# EAGLE design schematic (EAGLE 6.5.0)
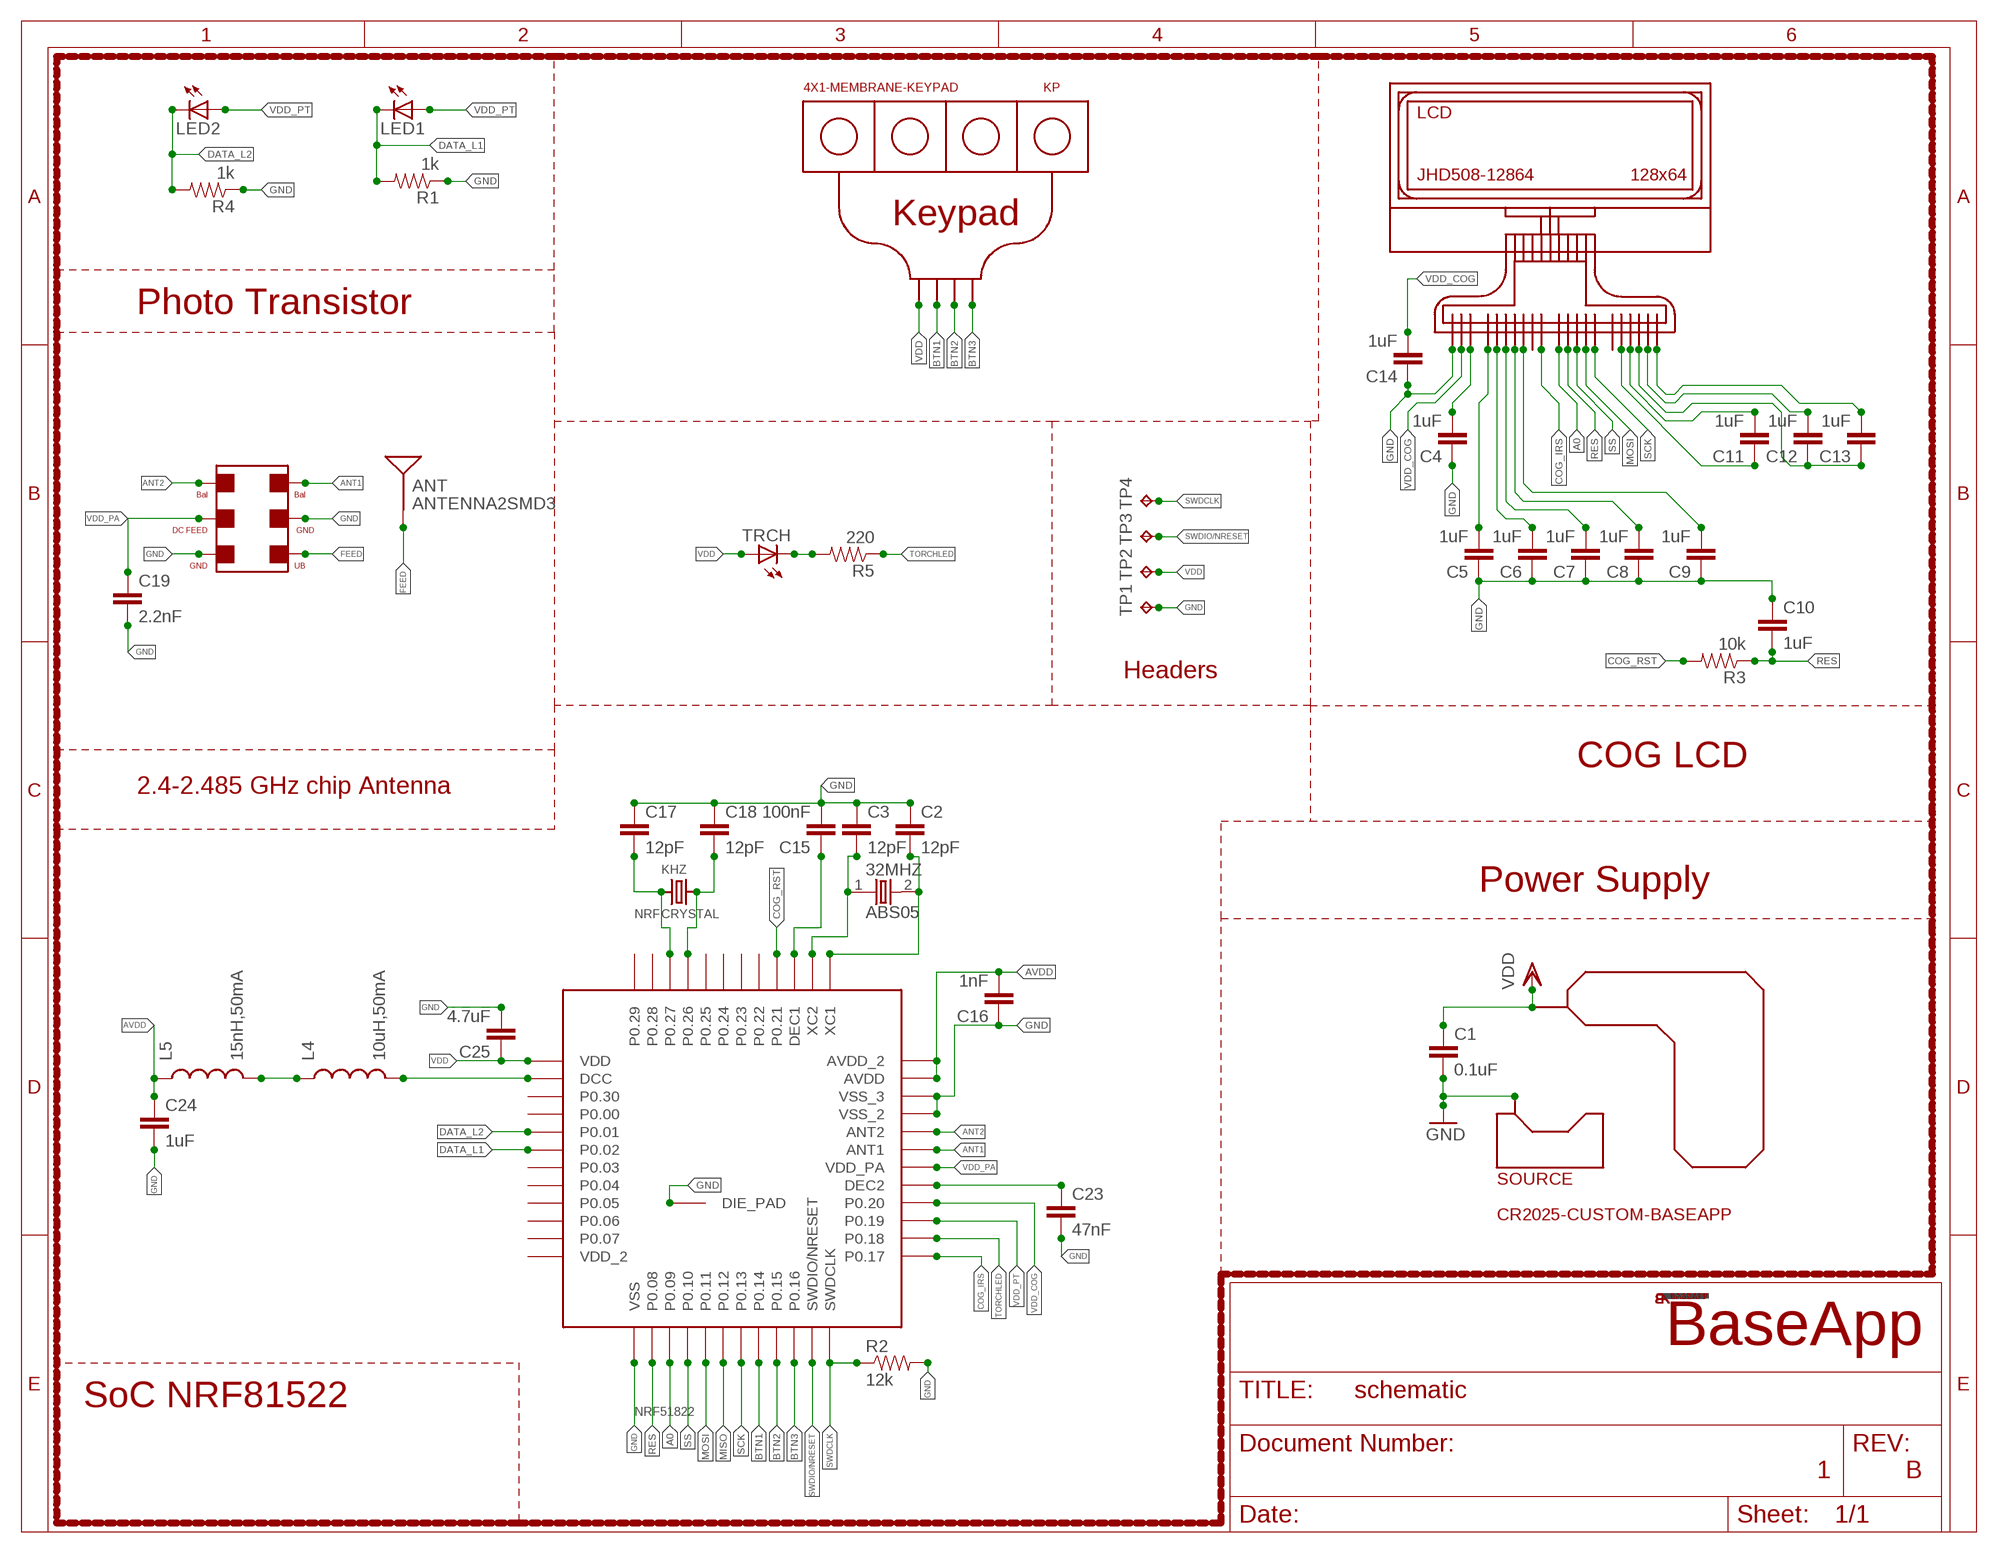
[diagram p0: schematic, sheet 1]

## Parts
32MHZ  ABS05  [ABS05]
ANT  ANTENNA2SMD3  [ANTENNA-CHIP4]
BU  2450BM14E0003_BALUN  [6PCPADS]
C1  0.1uF  CAP0402-CAP  [0402-CAP]
C2  12pF  CAP0402-CAP  [0402-CAP]
C3  12pF  CAP0402-CAP  [0402-CAP]
C4  1uF  CAP0402-CAP  [0402-CAP]
C5  1uF  CAP0402-CAP  [0402-CAP]
C6  1uF  CAP0402-CAP  [0402-CAP]
C7  1uF  CAP0402-CAP  [0402-CAP]
C8  1uF  CAP0402-CAP  [0402-CAP]
C9  1uF  CAP0402-CAP  [0402-CAP]
C10  1uF  CAP0402-CAP  [0402-CAP]
C11  1uF  CAP0402-CAP  [0402-CAP]
C12  1uF  CAP0402-CAP  [0402-CAP]
C13  1uF  CAP0402-CAP  [0402-CAP]
C14  1uF  CAP0402-CAP  [0402-CAP]
C15  100nF  CAP0402-CAP  [0402-CAP]
C16  1nF  CAP0402-CAP  [0402-CAP]
C17  12pF  CAP0402-CAP  [0402-CAP]
C18  12pF  CAP0402-CAP  [0402-CAP]
C19  2.2nF  CAP0402-CAP  [0402-CAP]
C23  47nF  CAP0402-CAP  [0402-CAP]
C24  1uF  CAP0402-CAP  [0402-CAP]
C25  4.7uF  CAP0402-CAP  [0402-CAP]
KHZ  CRYSTAL  [ABS05]
KP  4X1-MEMBRANE-KEYPAD  [4X1-MEMBRANE-KEYPAD]
L4  10uH,50mA  INDUCTOR0402  [C0402]
L5  15nH,50mA  INDUCTOR0402  [C0402]
LCD  JHD508-12864  [FSTN]
LED1  LEDCHIP-LED0805  [CHIP-LED0805]
LED2  LEDCHIP-LED0805  [CHIP-LED0805]
NRF  NRF51822  [QFN48]
R1  1k  RESISTOR0402-RES  [0402-RES]
R2  12k  RESISTOR0402-RES  [0402-RES]
R3  10k  RESISTOR0402-RES  [0402-RES]
R4  1k  RESISTOR0402-RES  [0402-RES]
R5  220  RESISTOR0402-RES  [0402-RES]
SOURCE  CR2025-CUSTOM-BASEAPP  [CR2025-CUSTOM-BASEAPP]
TP1  TPTP06SQ  [TP06SQ]
TP2  TPTP06SQ  [TP06SQ]
TP3  TPTP06SQ  [TP06SQ]
TP4  TPTP06SQ  [TP06SQ]
TRCH  LEDSML0603  [SML0603]

## Nets
A0: LCD.P$19(A0) NRF.15(P0.09)
ANT1: BU.P$3 NRF.31(ANT1)
ANT2: BU.P$4 NRF.32(ANT2)
AVDD: C16.2 C24.1 L5.1 NRF.35(AVDD) NRF.36(AVDD_2)
BTN1: KP.P$2 NRF.20(P0.14)
BTN2: KP.P$3 NRF.21(P0.15)
BTN3: KP.P$4 NRF.22(P0.16)
COG_IRS: LCD.P$1(IRS) NRF.25(P0.17)
COG_RST: NRF.40(P0.21) R3.2
DATA_L1: LED1.C NRF.6(P0.02) R1.2
DATA_L2: LED2.C NRF.5(P0.01) R4.2
FEED: ANT.SIG(SIGNAL) BU.P$1
GND: BU.P$2 BU.P$6 C1.2 C2.1 C3.1 C4.1 C5.1 C6.1 C7.1 C8.1 C9.1 C10.1 C14.1 C15.2 C16.1 C17.1 C18.1 C19.2 C23.2 C24.2 C25.2 LCD.P$15(GND) NRF.13(VSS) NRF.33(VSS_2) NRF.34(VSS_3) NRF.GND(DIE_PAD) R1.1 R2.2 R4.1 SOURCE.1(GND) TP1.TP
MISO: NRF.18(P0.12)
MOSI: LCD.P$17(SI) NRF.17(P0.11)
N$1: C11.2 LCD.P$10(CAP2N)
N$2: C18.2 KHZ.P$2 NRF.45(P0.26)
N$3: C4.2 LCD.P$14(VOUT)
N$4: C5.2 LCD.P$7(V1)
N$5: C15.1 NRF.39(DEC1)
N$7: C6.2 LCD.P$6(V2)
N$8: C7.2 LCD.P$5(V3)
N$9: C8.2 LCD.P$4(V4)
N$10: C9.2 LCD.P$3(V5)
N$11: C12.2 LCD.P$12(CAP1P)
N$12: C12.1 C13.1 LCD.P$11(CAP1N)
N$13: 32MHZ.1 C3.2 NRF.38(XC2)
N$14: 32MHZ.2 C2.2 NRF.37(XC1)
N$16: C23.1 NRF.29(DEC2)
N$17: C17.2 KHZ.P$1 NRF.46(P0.27)
N$18: L4.2 NRF.2(DCC)
N$19: C11.1 LCD.P$9(CAP2P)
N$20: L4.1 L5.2
N$21: R5.2 TRCH.C
N$23: C13.2 LCD.P$13(CAP3N)
RES: C10.2 LCD.P$20(/RES) NRF.14(P0.08) R3.1
SCK: LCD.P$18(SCL) NRF.19(P0.13)
SS: LCD.P$21(/CS1) NRF.16(P0.10)
SWDCLK: NRF.24(SWDCLK) R2.1 TP4.TP
SWDIO/NRESET: NRF.23(SWDIO/NRESET) TP3.TP
TORCHLED: NRF.26(P0.18) R5.1
VDD: C1.1 C25.1 KP.P$1 NRF.1(VDD) SOURCE.2(VDD) TP2.TP TRCH.A
VDD_COG: C14.2 LCD.P$16(VDD) NRF.28(P0.20)
VDD_PA: BU.P$5 C19.1 NRF.30(VDD_PA)
VDD_PT: LED1.A LED2.A NRF.27(P0.19)
Unconnected: LCD.P$2(VR) LCD.P$8(CAP4N) NRF.3(P0.30) NRF.4(P0.00) NRF.7(P0.03) NRF.8(P0.04) NRF.9(P0.05) NRF.10(P0.06) NRF.11(P0.07) NRF.12(VDD_2) NRF.41(P0.22) NRF.42(P0.23) NRF.43(P0.24) NRF.44(P0.25) NRF.47(P0.28) NRF.48(P0.29)

## Notes on the sheet
- Keypad
- Photo Transistor
- Headers
- COG LCD
- 2.4-2.485 GHz chip Antenna
- Power Supply
- BaseApp
- SoC NRF81522
- 1 | B

## Library data of the parts
32MHZ = baseOauth:ABS05
ANT = SparkFun-RF:ANTENNA2: Chip antenna Single endded antenna. Common with smaller chip antennas. CHIP4 package is the GPS Chip Antenna SKU: GPS-08418. CHIP5 package is 2.4GHz chip antenna SKU: WRL-00144.
BU = baseOauth:2450BM14E0003_BALUN
C1-C19 C23-C25 = SparkFun-Capacitors:CAP: Capacitor Standard 0603 ceramic capacitor, and 0.1" leaded capacitor.
KHZ = abracon:CRYSTAL
KP = baseOauth:4X1-MEMBRANE-KEYPAD
L4 L5 = SparkFun-Passives:INDUCTOR: Inductors Basic Inductor/Choke - 0603 and 1206. Footprints are not proven and vary greatly between part numbers. SRN6045- 33uH, 20% 1.4A SDR0403-560KL - 56uH, 10%, 500mA RMS/740mA peak
LCD = baseOauth:JHD508-12864
LED1 LED2 = adafruit:LED: LED
NRF = NordicSemi:NRF51822: Bluetooth 4.0 Low Energy/2.4Ghz NORDIC SEMICONDUCTOR
R1-R5 = SparkFun-Passives:RESISTOR: Resistor Basic schematic elements and footprints for 0603, 1206, and PTH resistors.
SOURCE = baseOauth:CR2025-CUSTOM-BASEAPP
TP1-TP4 = testpad:TP: Test pad
TRCH = led:LED: LED

## Net classes
0 default: width 0.152 mm, drill 0.305 mm, clearance 0.152 mm

## Board
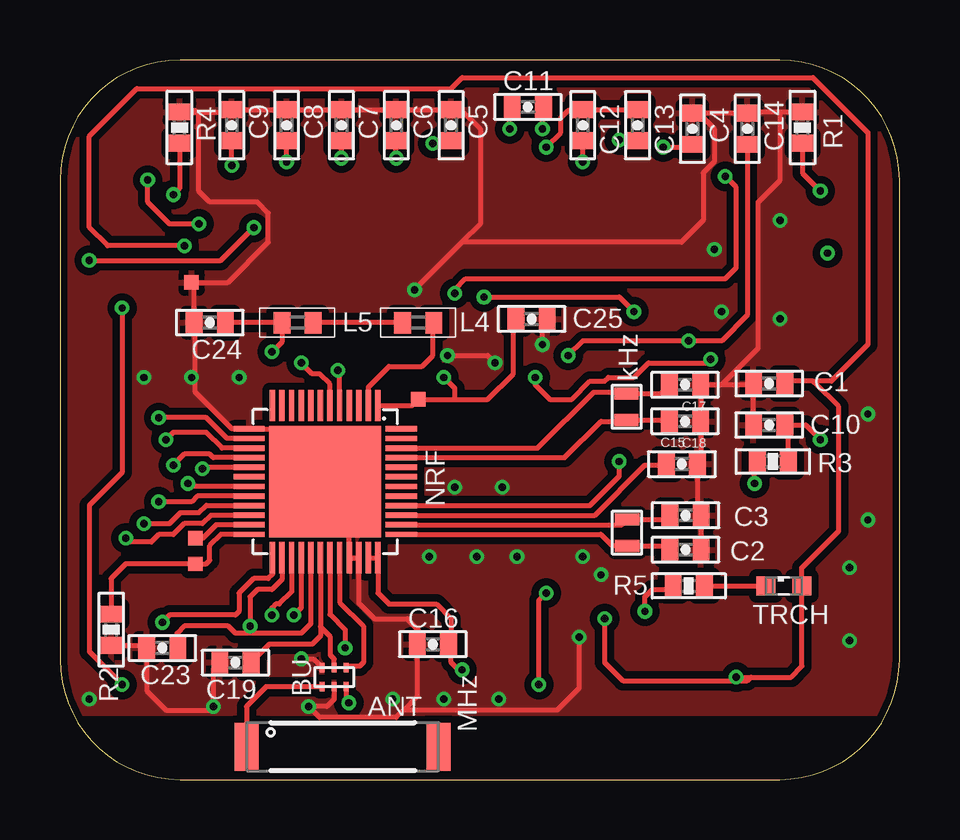
[diagram p1: board, top side]
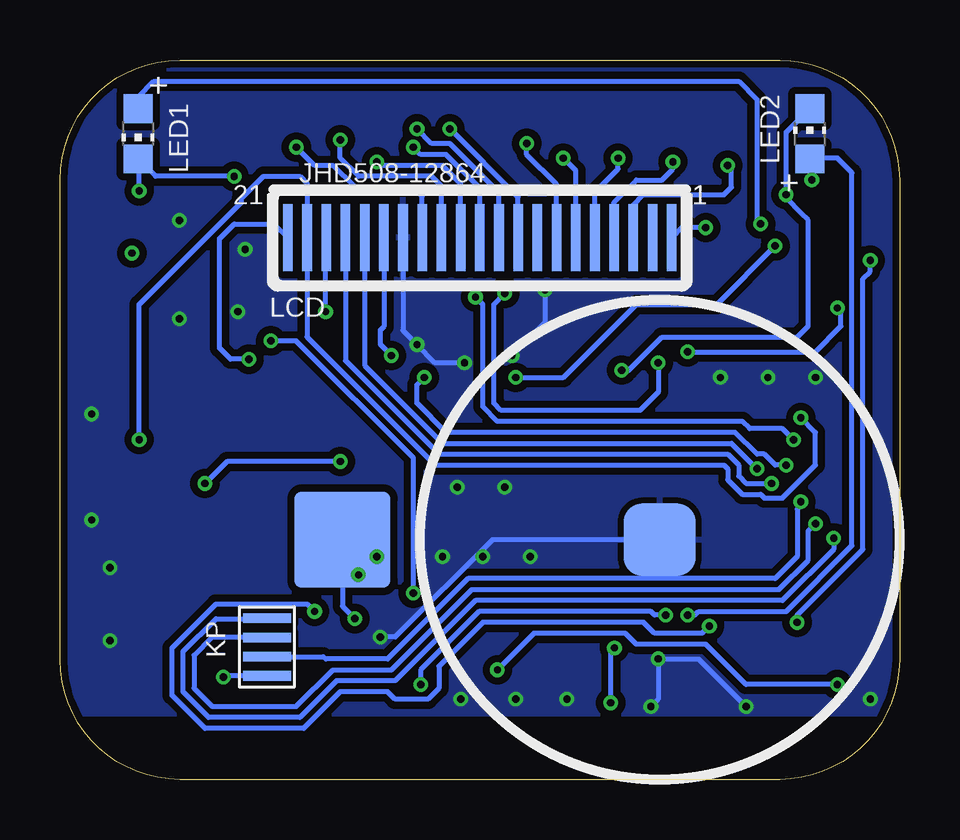
[diagram p2: board, bottom side, seen from below]

Size 35 x 30 mm. Coordinates in mm from the lower left corner, seen from the top.
Outline: 0,25 0,5 arc90 5,0 30,0 arc90 35,5 35,25 arc90 30,30 5,30 arc90 0,25
Copper layers (1*16): Top 0.035mm / dielectric 1.5mm / Bottom 0.035mm
Design rules "ITEADstudio_DRC": minimum track width 6mil, minimum drill 12mil, track to track 6mil, track to pad 6mil, pad to pad 6mil, via to via 6mil, smd to smd 0mil, copper to edge 10mil, drill to drill 10mil, minimum pad ring 10mil, minimum via ring 6mil, stop-mask expansion 2mil, vias tented up to drill 100mil, thermal gap 10mil

### Footprints (pad centres in the part's own frame; a part is rotated, then mirrored left to right if it is on the bottom)
ABS05 = smd 0.508 x 1.016: 1 -0.55,0; 2 0.55,0
ANTENNA-CHIP4 = smd 1 x 2: NC 4,0; SIG -4,0
6PCPADS = smd 0.4 x 0.2: P$1 -0.4,0.5; P$2 -0.4,0; P$3 -0.4,-0.5; P$4 0.4,-0.5; P$5 0.4,0; P$6 0.4,0.5
0402-CAP = smd 0.7 x 0.9: 1 -0.65,0; 2 0.65,0
ABS05' = smd 0.5 x 1: P$1 -0.55,0; P$2 0.55,0
4X1-MEMBRANE-KEYPAD = smd 0.4 x 2: P$1 -1.2,0; P$2 -0.4,0; P$3 0.4,0; P$4 1.2,0
C0402 = smd 0.7 x 0.9: 1 -0.65,0; 2 0.65,0
FSTN = smd 0.4 x 2.8: P$1 -8,1.4; P$2 -7.2,1.4; P$3 -6.4,1.4; P$4 -5.6,1.4; P$5 -4.8,1.4; P$6 -4,1.4; P$7 -3.2,1.4; P$8 -2.4,1.4; P$9 -1.6,1.4; P$10 -0.8,1.4; P$11 0,1.4; P$12 0.8,1.4; P$13 1.6,1.4; P$14 2.4,1.4; P$15 3.2,1.4; P$16 4,1.4; P$17 4.8,1.4; P$18 5.6,1.4; P$19 6.4,1.4; P$20 7.2,1.4; P$21 8,1.4
CHIP-LED0805 = smd 1.2 x 1.2: A 0,-1.05; C 0,1.05
QFN48 = smd 1.3 x 0.226: 1 -3.17,2.2; 2 -3.17,1.8; 3 -3.17,1.4; 4 -3.17,1; 5 -3.17,0.6; 6 -3.17,0.2; 7 -3.17,-0.2; 8 -3.17,-0.6; 9 -3.17,-1; 10 -3.17,-1.4; 11 -3.17,-1.8; 12 -3.17,-2.2; 25 3.17,-2.2; 26 3.17,-1.8; 27 3.17,-1.4; 28 3.17,-1; 29 3.17,-0.6; 30 3.17,-0.2; 31 3.17,0.2; 32 3.17,0.6; 33 3.17,1; 34 3.17,1.4; 35 3.17,1.8; 36 3.17,2.2 | smd 0.226 x 1.3: 13 -2.2,-3.17; 14 -1.8,-3.17; 15 -1.4,-3.17; 16 -1,-3.17; 17 -0.6,-3.17; 18 -0.2,-3.17; 19 0.2,-3.17; 20 0.6,-3.17; 21 1,-3.17; 22 1.4,-3.17; 23 1.8,-3.17; 24 2.2,-3.17; 37 2.2,3.17; 38 1.8,3.17; 39 1.4,3.17; 40 1,3.17; 41 0.6,3.17; 42 0.2,3.17; 43 -0.2,3.17; 44 -0.6,3.17; 45 -1,3.17; 46 -1.4,3.17; 47 -1.8,3.17; 48 -2.2,3.17 | smd 4.66 x 4.66: GND 0,0
0402-RES = smd 0.7 x 0.9: 1 -0.65,0; 2 0.65,0
CR2025-CUSTOM-BASEAPP = smd 3 x 3: 1 0,0 | smd 4 x 4: 2 13.224,0
TP06SQ = smd 0.6 x 0.6: TP 0,0
SML0603 = smd 0.8 x 0.8: A 0.75,0; C -0.75,0

### Placement (x,y rotation side)
32MHZ  23.64,10.29 270 top
ANT  11.79,1.37 0 top
BU  11.43,4.27 90 top
C1  29.57,16.51 180 top
C2  26.08,9.58 180 top
C3  26.08,11.02 180 top
C4  26.37,27.13 270 top
C5  16.31,27.28 270 top
C6  14.02,27.28 270 top
C7  11.73,27.28 270 top
C8  9.45,27.28 270 top
C9  7.16,27.28 270 top
C10  29.57,14.78 0 top
C11  19.51,28.04 0 top
C12  21.79,27.28 270 top
C13  24.08,27.28 270 top
C14  28.65,27.13 270 top
C15  25.93,13.15 0 top
C16  15.54,5.64 0 top
C17  26.06,16.46 180 top
C18  26.06,14.94 180 top
C19  7.32,4.88 180 top
C23  4.27,5.49 180 top
C24  6.25,19.05 180 top
C25  19.66,19.2 0 top
KHZ  CRYSTAL  [ABS05']  23.62,15.54 270 top
KP  26.37,5.52 90 bottom
L4  14.94,19.05 0 top
L5  9.91,19.05 0 top
LCD  17.5,24 180 bottom
LED1  31.74,26.92 180 bottom
LED2  3.74,26.92 0 bottom
NRF  11.06,12.42 270 top
R1  30.95,27.18 270 top
R2  2.13,6.25 270 top
R3  29.72,13.26 180 top
R4  4.98,27.18 270 top
R5  26.21,8.08 0 top
SOURCE  10,10 180 bottom
TP1  5.49,20.73 0 top
TP2  14.94,15.85 0 top
TP3  5.64,10.06 0 top
TP4  5.64,8.99 0 top
TRCH  30.18,8.08 0 top

### Tracks (layer width: path | path; a pad name or v marks a point on that pad's centre or on a via)
A0  (via drill 0.3)
  Top 0.203: NRF.15 6.75,13.82 6.1,14.48 4.72,14.48 v4.42,14.17 | v17.68,20.12 23.32,20.12 v23.93,19.51
  Bottom 0.203: v4.42,14.17 4.88,14.63 6.25,14.63 6.55,14.94 16.76,14.94 17.37,15.54 17.37,19.81 v17.68,20.12 | v23.93,19.51 23.93,22.57 LCD.P$19
ANT1  (via drill 0.3)
  Top 0.203: NRF.31 11.26,6.88 11.89,6.25 v11.89,5.49 | 11.89,3.35 v12.04,3.2 11.93,3.24 BU.P$3
  Bottom 0.203: v12.04,3.2 12.04,5.33 v11.89,5.49
ANT2
  Top 0.203: NRF.32 11.66,7.39 12.65,6.4 12.65,4.88 12.5,4.72 11.99,4.72 BU.P$4
AVDD  (via drill 0.3)
  Top 0.203: NRF.35 NRF.36 13.26,7.78 13.72,7.32 15.7,7.32 16.31,6.71 16.31,5.75 C16.2 16.31,5.53 16.31,4.88 16.61,4.57 v16.76,4.57 | C24.1 L5.1 9.26,18.25 v8.84,17.83 | v2.59,19.66 2.59,12.8 1.22,11.43 1.22,5.33 v2.59,3.96
  Bottom 0.203: v8.84,17.83 3.5,17.83 2.44,18.9 2.44,19.51 v2.59,19.66 | v2.59,3.96 6.4,3.96 8.08,5.64 10.97,5.64 11.43,6.1 15.24,6.1 v16.76,4.57
BTN1  (via drill 0.3)
  Top 0.203: NRF.20 5.72,11.82 5.49,11.58 v4.12,11.58
  Bottom 0.203: v4.12,11.58 4.12,11.43 4.27,11.28 4.27,9.3 5.18,8.38 17.98,8.38 21.34,5.03 23.93,5.03 24.02,5.12 KP.P$2
BTN2  (via drill 0.3)
  Top 0.203: v3.5,10.67 4.57,10.67 5.03,11.12 5.79,11.12 6.1,11.43 7.88,11.43 NRF.21
  Bottom 0.203: KP.P$3 28.67,5.92 29.41,5.18 29.41,3.81 28.65,3.05 25.15,3.05 23.62,4.57 21.18,4.57 17.83,7.92 5.03,7.92 3.81,9.14 3.81,10.36 v3.5,10.67
BTN3  (via drill 0.3)
  Top 0.203: NRF.22 6.29,11.02 5.94,10.67 5.18,10.67 4.72,10.21 4.12,10.21 3.81,9.91 2.9,9.91 v2.74,10.06
  Bottom 0.203: v2.74,10.06 2.74,9.6 4.88,7.47 17.68,7.47 21.03,4.12 23.47,4.12 24.99,2.59 28.8,2.59 29.87,3.66 29.87,5.33 28.5,6.71 26.39,6.71 KP.P$4
COG_IRS  (via drill 0.3)
  Top 0.203: NRF.25 8.86,8.55 8.69,8.38 8.08,8.38 7.47,7.77 7.47,7.01 7.32,6.86 4.57,6.86 v4.27,6.55 | v1.22,21.64 6.71,21.64 v8.08,23.01
  Bottom 0.203: v4.27,6.55 4.27,6.86 1.52,9.6 1.52,20.88 1.22,21.18 v1.22,21.64 | v8.08,23.01 9.09,23.01 LCD.P$1
COG_RST  (via drill 0.3)
  Top 0.203: NRF.40 22.09,11.42 23.32,12.65 v23.32,13.26 | v28.96,12.34 28.96,13.15 R3.2
  Bottom 0.203: v23.32,13.26 28.04,13.26 v28.96,12.34
DATA_L1  (via drill 0.3)
  Top 0.203: NRF.6 11.26,16.48 10.82,16.92 10.52,16.92 v10.06,17.37 | v16.46,20.27 16.46,20.42 16.92,20.88 27.74,20.88 28.19,21.34 28.19,24.69 v27.74,25.15 | R1.2 30.95,25.28 v31.7,24.54
  Bottom 0.203: v10.06,17.37 10.06,16.15 10.82,15.39 16.61,15.39 16.92,15.7 16.92,19.81 v16.46,20.27 | v27.74,25.15 31.02,25.15 LED1.C 31.7,25.83 v31.7,24.54
DATA_L2  (via drill 0.3)
  Top 0.203: NRF.5 11.66,17 v11.58,17.07 | R4.2 4.98,24.64 v4.72,24.38
  Bottom 0.203: v11.58,17.07 11.28,17.07 9.91,18.44 4.27,18.44 3.81,18.9 3.81,23.32 4.12,23.62 4.72,24.23 v4.72,24.38 4.72,26.99 LED2.C
FEED
  Top 0.203: BU.P$1 8.59,3.87 7.77,3.05 7.77,1.39 ANT.SIG
GND  (via drill 0.3)
  Top 0.203: BU.P$2 11.43,3.35 11.12,3.05 v10.36,3.05 10.82,2.59 14.02,2.59 14.33,2.9 | v10.06,5.03 10.57,5.03 BU.P$6 | C19.2 6.4,4.61 v6.4,3.05 6.25,2.9 4.42,2.9 3.62,3.7 C23.2 3.5,5.6 R2.2 | 14.33,2.9 14.89,3.46 C16.1 14.94,5.68 14.94,6.25 14.48,6.71 13.11,6.71 12.46,7.36 NRF.34 NRF.33 12.06,11.42 NRF.GND 8.86,14.62 NRF.13 7.17,14.62 5.64,16.15 5.64,19.01 C24.2 5.6,20.61 TP1.TP 7.01,20.73 8.69,22.4 8.69,23.62 8.23,24.08 6.25,24.08 5.79,24.54 5.79,27.74 5.64,27.89 5.04,27.89 R4.1 7.07,27.83 C9.1 C8.1 C7.1 C6.1 C5.1 16.72,27.93 17.53,27.13 17.53,23.16 16.76,22.4 | C17.1 C18.1 26.71,13.29 C15.2 26.58,11.17 C3.1 C2.1 | C10.1 C1.2 28.86,16.46 C17.1 | R1.1 30.02,27.83 | 30.02,27.83 28.71,27.83 C14.1 C4.1 26.63,27.78 27.28,27.13 27.28,25.76 26.82,25.3 26.82,23.32 25.91,22.4 16.76,22.4 | 16.76,22.4 v14.78,20.42 | v16.15,17.68 17.83,17.68 v18.14,17.37 | v20.12,18.14 20.12,19.01 C25.2 | v21.64,5.94 21.64,3.81 20.73,2.9 14.33,2.9 | C17.1 27.58,16.46 29.11,17.98 29.11,24.08 30.02,24.99 30.02,27.83
  Bottom 0.203: v10.36,3.05 10.06,3.35 v10.06,5.03 8.38,5.03 v6.4,3.05 | v14.78,20.42 14.78,19.05 v16.15,17.68 | v18.14,17.37 19.36,17.37 v20.12,18.14 20.7,18.72 LCD.P$15 | SOURCE.1 16.98,10 21.03,5.94 v21.64,5.94
  other vias: 5.49,16.76 32.92,5.79 32.92,8.84 33.68,10.82 33.68,15.24 13.87,3.35 16,3.35 1.22,3.35 3.51,16.76 7.47,16.76 30.02,23.32 30.02,19.2 27.58,19.51 27.28,22.1 16.46,12.19 18.44,12.19 19.05,9.3 17.37,9.3 15.39,9.3 21.79,9.3 22.56,8.53 18.29,3.35
  pour Top (isolate 0.305): -2.13,30.48 37.8,30.48 37.8,2.74 -2.13,2.74
  pour Bottom (isolate 0.305): -4.11,32.77 39.17,32.77 39.17,2.74 -4.11,2.74
MOSI  (via drill 0.3)
  Top 0.203: NRF.17 6.01,13.02 v5.94,12.95
  Bottom 0.203: LCD.P$17 22.3,17.27 19.05,14.02 7.01,14.02 v5.94,12.95
N$1  (via drill 0.3)
  Top 0.203: v20.12,27.13 20.12,28 C11.2
  Bottom 0.203: LCD.P$10 16.7,24.47 18.75,26.52 19.51,26.52 v20.12,27.13
N$2
  Top 0.203: NRF.45 21.04,13.42 22.55,14.94 23.56,14.94 KHZ.P$2 25.35,14.99 C18.2
N$3  (via drill 0.3)
  Top 0.203: v25.15,26.36 26.25,26.36 C4.2
  Bottom 0.203: LCD.P$14 19.9,24.32 20.27,24.69 22.71,24.69 23.62,25.6 24.38,25.6 v25.15,26.36
N$4  (via drill 0.3)
  Top 0.203: v15.54,26.52 16.2,26.52 C5.2
  Bottom 0.203: LCD.P$7 14.3,24.82 15.54,26.06 v15.54,26.52
N$5
  Top 0.203: NRF.39 22.3,11.02 24.38,13.11 25.23,13.11 C15.1
N$6  (via drill 0.3)
  other vias: 32,21.95
N$7  (via drill 0.3)
  Top 0.203: v14.02,25.91 C6.2
  Bottom 0.203: LCD.P$6 13.5,25.39 v14.02,25.91
N$8  (via drill 0.3)
  Top 0.203: v11.73,25.91 C7.2
  Bottom 0.203: LCD.P$5 12.7,24.49 11.73,25.45 v11.73,25.91
N$9  (via drill 0.3)
  Top 0.203: v9.45,25.76 C8.2
  Bottom 0.203: LCD.P$4 11.9,24.07 10.97,24.99 9.91,24.99 9.45,25.45 v9.45,25.76
N$10  (via drill 0.3)
  Top 0.203: v7.16,25.6 C9.2
  Bottom 0.203: LCD.P$3 11.1,23.95 10.67,24.38 7.32,24.38 7.01,24.69 7.01,25.45 v7.16,25.6
N$11  (via drill 0.3)
  Top 0.203: v21.79,25.76 C12.2
  Bottom 0.203: LCD.P$12 18.3,24.85 19.05,25.6 21.64,25.6 v21.79,25.76
N$12  (via drill 0.3)
  Top 0.203: v20.27,26.36 20.88,26.98 20.88,27.58 21.18,27.89 21.75,27.89 C12.1 C13.1
  Bottom 0.203: LCD.P$11 17.5,24.66 18.9,26.06 19.96,26.06 v20.27,26.36
N$13
  Top 0.203: NRF.38 23.42,10.62 32MHZ.1 25.25,10.84 C3.2
N$14
  Top 0.203: NRF.37 22.55,10.22 23.01,9.75 23.63,9.75 32MHZ.2 25.27,9.74 C2.2
N$16
  Top 0.203: NRF.29 10.46,6.49 10.06,6.1 7.32,6.1 7.01,6.4 5.18,6.4 4.88,6.1 4.88,5.53 C23.1
N$17
  Top 0.203: NRF.46 19.92,13.82 22.25,16.15 23.56,16.15 KHZ.P$1 25.05,16.09 C17.2
N$18
  Top 0.203: NRF.2 12.86,16.36 13.72,17.22 15.09,17.22 15.54,17.68 15.54,19.01 L4.2
N$19  (via drill 0.3)
  Top 0.203: v18.75,27.13 18.75,27.93 C11.1
  Bottom 0.203: LCD.P$9 15.9,24.28 v18.75,27.13
N$20
  Top 0.203: L4.1 L5.2
N$21
  Top 0.203: R5.2 TRCH.C
N$23  (via drill 0.3)
  Top 0.203: v23.32,26.67 24.04,26.67 C13.2
  Bottom 0.203: LCD.P$13 19.1,24.74 19.51,25.15 22.55,25.15 23.32,25.91 v23.32,26.67
RES  (via drill 0.3)
  Top 0.203: NRF.14 6.96,14.22 6.1,15.09 v4.12,15.09 | R3.1 30.37,14.63 C10.2 31.09,14.78 v31.7,14.17
  Bottom 0.203: v4.12,15.09 3.5,14.48 3.5,13.11 4.88,11.73 5.64,11.73 5.79,11.89 6.55,11.89 7.16,12.5 7.16,12.95 7.32,13.11 19.36,13.11 24.7,18.45 LCD.P$20 24.69,22.61 24.69,24.84 24.99,25.15 26.52,25.15 27.43,24.23 27.43,24.08 31.7,19.81 v31.7,14.17
SCK  (via drill 0.3)
  Top 0.203: NRF.19 5.46,12.22 v5.33,12.34
  Bottom 0.203: LCD.P$18 23.1,17.46 19.2,13.56 7.16,13.56 6.71,13.11 6.71,12.65 6.4,12.34 v5.33,12.34
SS  (via drill 0.3)
  Top 0.203: NRF.16 6.39,13.42 6.25,13.56 5.18,13.56 v4.72,13.11 | v19.81,16.76 19.81,16.46 20.42,15.85 21.34,15.85 22.1,16.61 22.71,16.61 22.86,16.76 23.93,16.76 24.54,17.37 26.98,17.37 v27.13,17.53
  Bottom 0.203: v4.72,13.11 5.18,13.11 5.64,13.56 5.94,13.56 6.86,14.48 18.9,14.48 20.12,15.7 20.12,16.46 v19.81,16.76 | v27.13,17.53 27.89,17.53 28.35,17.98 28.35,22.55 27.74,23.16 26.07,23.16 LCD.P$21
SWDCLK
  Top 0.203: NRF.24 6.71,10.22 6.25,9.75 6.25,9.14 6.1,8.99 TP4.TP 2.74,8.99 2.13,8.38 R2.1
SWDIO/NRESET
  Top 0.203: NRF.23 6.5,10.62 5.94,10.06 TP3.TP
TORCHLED  (via drill 0.3)
  Top 0.203: NRF.26 9.26,8.34 8.84,7.92 8.23,7.92 7.92,7.62 v7.92,6.4 | v24.38,7.01 24.38,7.62 24.69,7.92 25.41,7.92 R5.1
  Bottom 0.203: v7.92,6.4 8.23,6.1 10.21,6.1 10.67,6.55 17.37,6.55 19.2,4.72 19.2,3.81 19.66,3.35 21.03,3.35 21.34,3.66 23.32,3.66 24.84,2.13 28.96,2.13 30.33,3.5 30.33,5.49 28.5,7.32 24.69,7.32 v24.38,7.01
VDD  (via drill 0.3)
  Top 0.203: NRF.1 14.68,15.59 TP2.TP 16.46,15.85 | C25.1 18.9,19.09 18.9,16.92 17.83,15.85 16.46,15.85 | v28.19,4.27 28.8,4.27 | 28.8,4.27 30.48,4.27 30.94,4.72 30.94,8.06 TRCH.A 30.93,8.83 32.46,10.36 32.46,15.54 31.47,16.54 | 31.47,16.54 31.39,16.61 30.32,16.61 C1.1 | v22.71,6.71 22.71,4.88 23.47,4.12 28.65,4.12 28.8,4.27 | 16.46,15.85 16.46,16.31 v16,16.76 | v5.18,22.25 1.98,22.25 1.22,23.01 1.22,26.82 3.2,28.8 16.31,28.8 16.76,29.26 31.39,29.26 33.68,26.98 33.68,18.14 32.16,16.61 31.55,16.61 31.47,16.54
  Bottom 0.203: KP.P$1 28.14,4.32 v28.19,4.27 | SOURCE.2 23.22,7.22 v22.71,6.71 | v16,16.76 14.02,16.76 10.97,19.81 7.62,19.81 v5.18,22.25
VDD_COG  (via drill 0.3)
  Top 0.203: NRF.28 10.06,7.16 v9.75,6.86 | v19.96,3.96 19.96,7.47 v20.27,7.77 | v21.18,17.68 21.79,18.29 v26.21,18.29 27.58,18.29 28.65,19.36 C14.2
  Bottom 0.203: v9.75,6.86 10.21,6.86 10.36,7.01 17.53,7.01 19.96,4.57 v19.96,3.96 | v21.18,17.68 21.64,18.14 21.64,18.75 21.5,18.89 LCD.P$16 | v20.27,7.77 20.27,13.41 25.15,18.29 v26.21,18.29
VDD_PA
  Top 0.203: NRF.30 10.86,6.37 | BU.P$5 11.43,5.03 11.28,5.18 11.28,5.94 10.86,6.37 | 10.86,6.37 10.86,5.98 10.52,5.64 8.73,5.64 C19.1
VDD_PT  (via drill 0.3)
  Top 0.203: NRF.27 9.66,7.83 9.14,7.32 8.99,7.32 8.84,7.16 v8.84,6.86 | v5.79,23.16 4.57,23.16 3.66,24.08 v3.66,24.99
  Bottom 0.203: v8.84,6.86 8.53,6.86 8.38,7.01 4.72,7.01 1.98,9.75 1.98,25.3 2.59,25.91 3.71,25.91 LED2.A 3.66,25.79 v3.66,24.99 | LED1.A 31.74,28.45 31.09,29.11 6.71,29.11 5.94,28.35 5.94,23.32 v5.79,23.16

### Text on the board
tPlace: kHz | MHz